# EAGLE board enigma (EAGLE 7.7.0), part 1 of 2
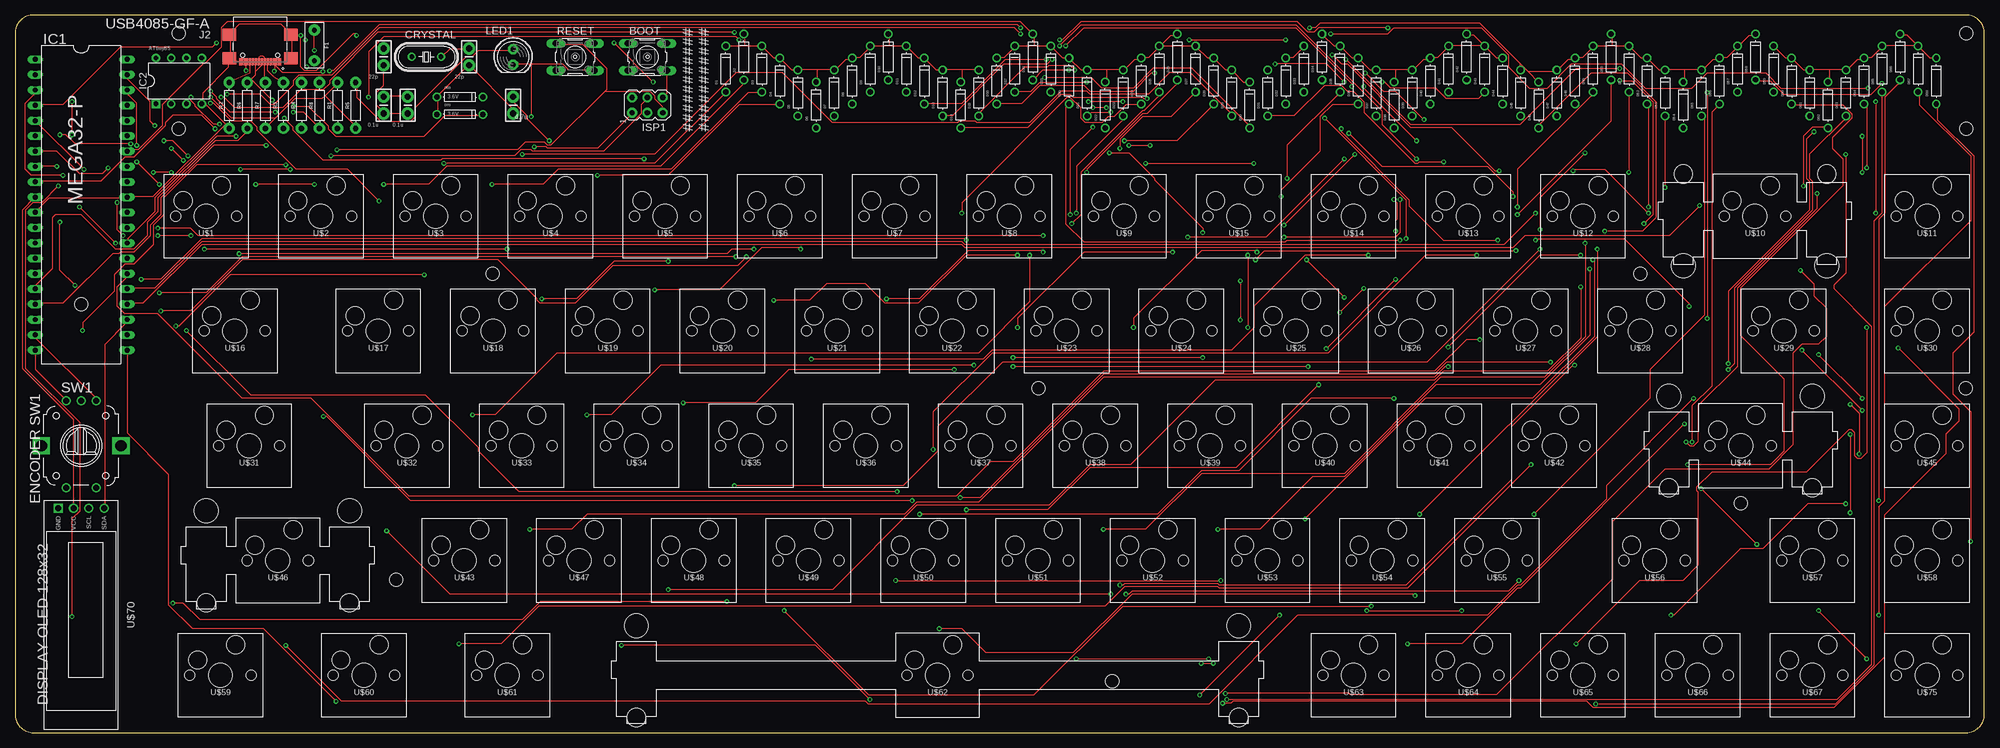
[diagram p2: board, top side]
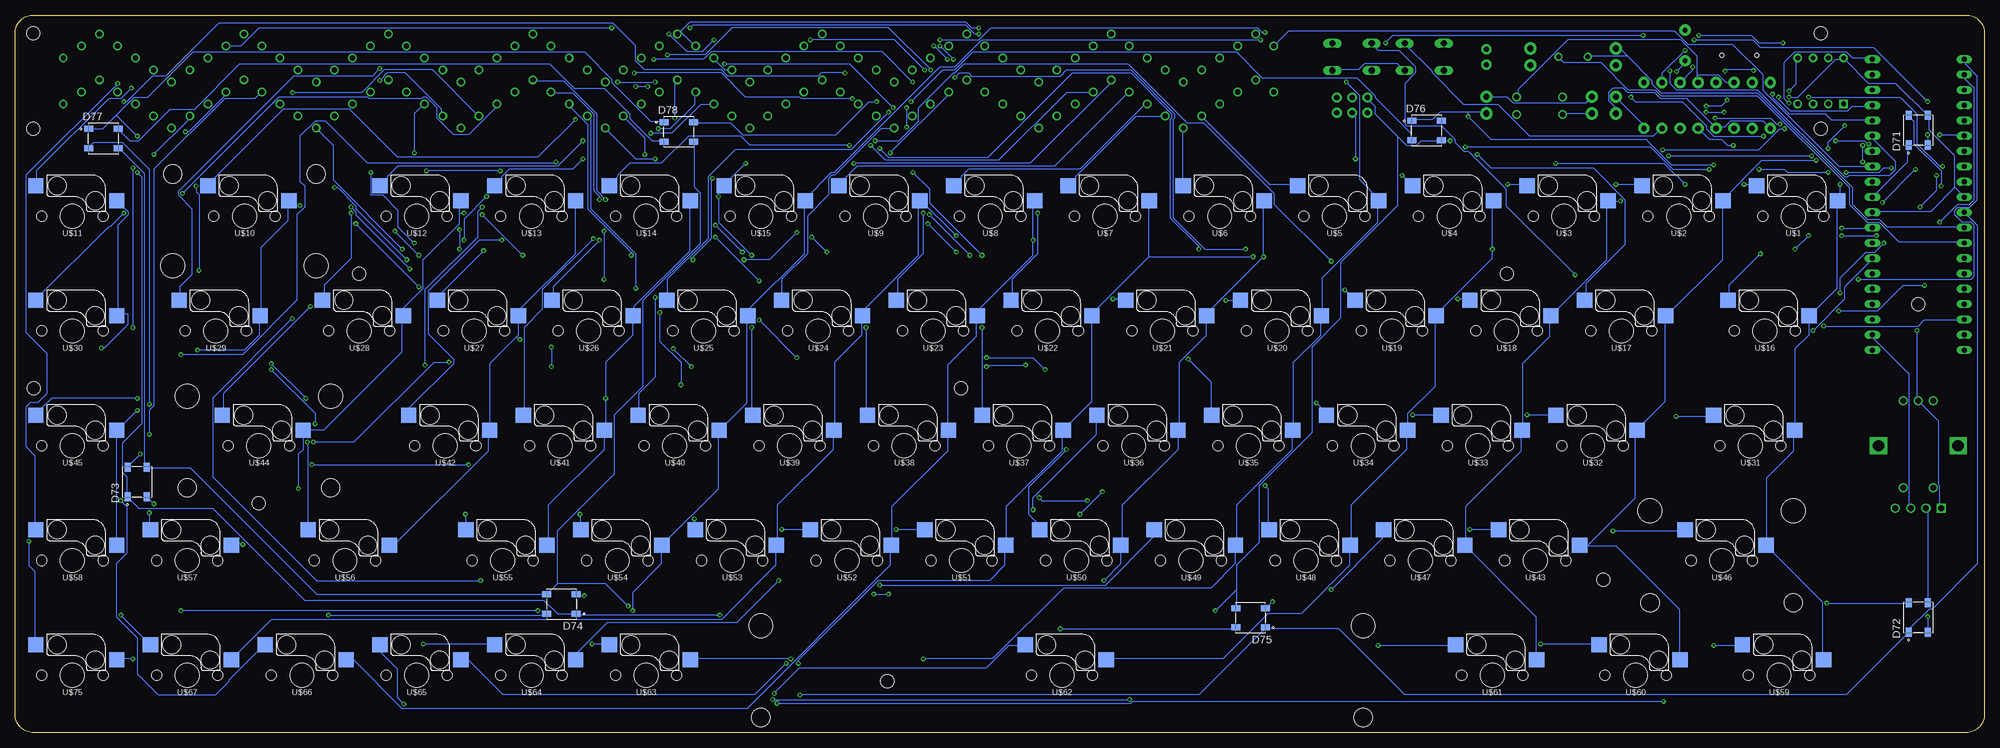
[diagram p3: board, bottom side, seen from below]

Size 327 x 119.12 mm. Coordinates in mm from the lower left corner, seen from the top.
Outline: 327,3.07 327,116.05 arc90 323.93,119.12 3.07,119.12 arc90 0,116.05 0,3.07 arc90 3.07,0 323.93,0 arc90 327,3.07
Copper layers (1*16): Top 0.035mm / dielectric 1.5mm / Bottom 0.035mm
Design rules "default *": minimum track width 6mil, minimum drill 0.35mm, track to track 6mil, track to pad 6mil, pad to pad 6mil, via to via 6mil, smd to smd 6mil, copper to edge 40mil, drill to drill 6mil, minimum pad ring 10mil, minimum via ring 8mil, stop-mask expansion 4mil, vias tented up to drill 0mil, thermal gap 10mil
Holes 2.2 mm at 27.2,116.12 27.2,100.25 324,116.12 324,100.25 269.85,76.2 182.17,8.5 10.97,71.11 323.9,57.15 169.95,57.15 79.33,76.2 286.52,38.1 63.25,25.39

## Footprints (pad centres in the part's own frame; a part is rotated, then mirrored left to right if it is on the bottom)
B3F-10XX = drill 1.016 long: 1 -3.251,2.261; 2 3.251,2.261; 3 -3.251,-2.261; 4 3.251,-2.261
HC49U-V = drill 0.813: 1 -2.413,0; 2 2.413,0
DO-1N4148 = drill 0.9: A -3.81,0; C 3.81,0
LED_1655 = smd 1.5 x 1: 1 -2.45,1.6; 2 -2.45,-1.6; 3 2.45,-1.6; 4 2.45,1.6
PTH = drill 0.8 pad 1.88: P$1 -2.54,0; P$2 2.54,0
DIL40 = drill 0.813 long: 1 -24.13,-7.62; 2 -21.59,-7.62; 3 -19.05,-7.62; 4 -16.51,-7.62; 5 -13.97,-7.62; 6 -11.43,-7.62; 7 -8.89,-7.62; 8 -6.35,-7.62; 9 -3.81,-7.62; 10 -1.27,-7.62; 11 1.27,-7.62; 12 3.81,-7.62; 13 6.35,-7.62; 14 8.89,-7.62; 15 11.43,-7.62; 16 13.97,-7.62; 17 16.51,-7.62; 18 19.05,-7.62; 19 21.59,-7.62; 20 24.13,-7.62; 21 24.13,7.62; 22 21.59,7.62; 23 19.05,7.62; 24 16.51,7.62; 25 13.97,7.62; 26 11.43,7.62; 27 8.89,7.62; 28 6.35,7.62; 29 3.81,7.62; 30 1.27,7.62; 31 -1.27,7.62; 32 -3.81,7.62; 33 -6.35,7.62; 34 -8.89,7.62; 35 -11.43,7.62; 36 -13.97,7.62; 37 -16.51,7.62; 38 -19.05,7.62; 39 -21.59,7.62; 40 -24.13,7.62
DIL08 = drill 0.8 pad 1.4 square: 1 -3.81,-3.81 | drill 0.8 pad 1.4: 2 -1.27,-3.81; 3 1.27,-3.81; 4 3.81,-3.81; 5 3.81,3.81; 6 1.27,3.81; 7 -1.27,3.81; 8 -3.81,3.81
AVRISP = drill 0.9 pad 1.626: 1 -1.27,2.54; 2 1.27,2.54; 3 -1.27,0; 4 1.27,0; 5 -1.27,-2.54; 6 1.27,-2.54
GCT_USB4110-GF-A_REVB = smd 0.6 x 1.15: A1/B12 -3.2,1.075; A4/B9 -2.4,1.075; B1/A12 3.2,1.075; B4/A9 2.4,1.075 | smd 0.3 x 1.15: A5 -1.25,1.075; A6 -0.25,1.075; A7 0.25,1.075; A8 1.25,1.075; B5 1.75,1.075; B6 0.75,1.075; B7 -0.75,1.075; B8 -1.75,1.075 | smd 2.18 x 2: S1 -5.11,0.5; S2 5.11,0.5; S3 -5.11,-3.43; S4 5.11,-3.43 | hole 0.65: -2.89,0; 2.89,0
LED5MM = drill 0.813 pad 1.676 octagon: A -1.27,0; K 1.27,0
AXIAL-0.3 = drill 0.9 pad 1.88: P$1 -3.81,0; P$2 3.81,0
PEC12_INCREMENTAL_ENCODER = drill 1: A -2.5,-7.5; B 2.5,-7.5; C 0,-7.5; P1 -2.5,7; P2 2.5,7 | drill 1.9 square: GND@1 -6.6,0; GND@2 6.6,0
MXHSPCB-1U = smd 2.55 x 2.5: MX1 7.36,2.54; MX2 -6.09,5.08 | hole 4: 0,0 | hole 1.7: 5.08,0; -5.08,0 | hole 3: 3.81,2.54; -2.54,5.08
MXHSPCB-2U = smd 2.55 x 2.5: MX1 7.36,2.54; MX2 -6.09,5.08 | hole 4: 0,0; -11.9,-8.24; 11.9,-8.24 | hole 1.7: 5.08,0; -5.08,0 | hole 3: 3.81,2.54; -2.54,5.08 | hole 3.05: -11.9,7; 11.9,7
MXHSPCB-2U-FLIPPED = smd 2.55 x 2.5: MX1 7.36,2.54; MX2 -6.09,5.08 | hole 4: 0,0; -11.9,8.24; 11.9,8.24 | hole 1.7: 5.08,0; -5.08,0 | hole 3: 3.81,2.54; -2.54,5.08 | hole 3.05: -11.9,-7; 11.9,-7
MXHSPCB-6.25U-FLIPPED = smd 2.55 x 2.5: MX1 7.36,2.54; MX2 -6.09,5.08 | hole 4: 0,0; -50,8.24; 50,8.24 | hole 1.7: 5.08,0; -5.08,0 | hole 3: 3.81,2.54; -2.54,5.08 | hole 3.05: -50,-7; 50,-7
CAP-TH = drill 1.016 pad 2.032: 1 -1.397,0; 2 1.397,0
DISPLAY-OLED-128X32 = drill 1 square: 1 -17.78,-3.81 | drill 1: 2 -17.78,-1.27; 3 -17.78,1.27; 4 -17.78,3.81

## Placement (x,y rotation side)
BOOT  BOOT  [B3F-10XX]  105,112.17 0 top
CRYSTAL  16MHZ  [HC49U-V]  68.3,112.17 0 top
D1  [DO-1N4148]  118,110.17 90 top
D2  [DO-1N4148]  121,112.17 90 top
D3  [DO-1N4148]  124,110.17 90 top
D4  [DO-1N4148]  127,108.17 90 top
D5  [DO-1N4148]  130,106.17 90 top
D6  [DO-1N4148]  133,104.17 90 top
D7  [DO-1N4148]  136,106.17 90 top
D8  [DO-1N4148]  139,108.17 90 top
D9  [DO-1N4148]  142,110.17 90 top
D10  [DO-1N4148]  145,112.17 90 top
D11  [DO-1N4148]  148,110.17 90 top
D12  [DO-1N4148]  151,108.17 90 top
D13  [DO-1N4148]  154,106.17 90 top
D14  [DO-1N4148]  157,104.17 90 top
D15  [DO-1N4148]  160,106.17 90 top
D16  [DO-1N4148]  163,108.17 90 top
D17  [DO-1N4148]  166,110.17 90 top
D18  [DO-1N4148]  169,112.17 90 top
D19  [DO-1N4148]  172,110.17 90 top
D20  [DO-1N4148]  175,108.17 90 top
D21  [DO-1N4148]  178,106.17 90 top
D22  [DO-1N4148]  181,104.17 90 top
D23  [DO-1N4148]  184,106.17 90 top
D24  [DO-1N4148]  187,108.17 90 top
D25  [DO-1N4148]  190,110.17 90 top
D26  [DO-1N4148]  193,112.17 90 top
D27  [DO-1N4148]  196,110.17 90 top
D28  [DO-1N4148]  199,108.17 90 top
D29  [DO-1N4148]  202,106.17 90 top
D30  [DO-1N4148]  205,104.17 90 top
D31  [DO-1N4148]  208,106.17 90 top
D32  [DO-1N4148]  211,108.17 90 top
D33  [DO-1N4148]  214,110.18 90 top
D34  [DO-1N4148]  217,112.18 90 top
D35  [DO-1N4148]  220,110.18 90 top
D36  [DO-1N4148]  223,108.18 90 top
D37  [DO-1N4148]  226,106.18 90 top
D38  [DO-1N4148]  229,104.18 90 top
D39  [DO-1N4148]  232,106.18 90 top
D40  [DO-1N4148]  235,108.18 90 top
D41  [DO-1N4148]  238,110.18 90 top
D42  [DO-1N4148]  241,112.18 90 top
D43  [DO-1N4148]  244,110.18 90 top
D44  [DO-1N4148]  247,108.18 90 top
D45  [DO-1N4148]  250,106.18 90 top
D46  [DO-1N4148]  253,104.18 90 top
D47  [DO-1N4148]  256,106.18 90 top
D48  [DO-1N4148]  259,108.18 90 top
D49  [DO-1N4148]  262,110.18 90 top
D50  [DO-1N4148]  265,112.18 90 top
D51  [DO-1N4148]  268,110.18 90 top
D52  [DO-1N4148]  271,108.18 90 top
D53  [DO-1N4148]  274,106.18 90 top
D54  [DO-1N4148]  277,104.18 90 top
D55  [DO-1N4148]  280,106.18 90 top
D56  [DO-1N4148]  283,108.18 90 top
D57  [DO-1N4148]  286,110.18 90 top
D58  [DO-1N4148]  289,112.18 90 top
D59  [DO-1N4148]  292,110.18 90 top
D60  [DO-1N4148]  295,108.18 90 top
D61  [DO-1N4148]  298,106.18 90 top
D62  [DO-1N4148]  301,104.18 90 top
D63  [DO-1N4148]  304,106.18 90 top
D64  [DO-1N4148]  307,108.18 90 top
D65  [DO-1N4148]  310,110.18 90 top
D66  [DO-1N4148]  313,112.18 90 top
D67  [DO-1N4148]  316,110.18 90 top
D68  [DO-1N4148]  319,108.18 90 top
D69  3.6V  [DO-1N4148]  73.87,105.51 0 top
D70  3.6V  [DO-1N4148]  73.87,102.64 0 top
D71  1655  [LED_1655]  10.97,100 90 bottom
D72  1655  [LED_1655]  10.97,19.12 90 bottom
D73  1655  [LED_1655]  306.73,41.6 90 bottom
D74  1655  [LED_1655]  236.26,21.34 180 bottom
D75  1655  [LED_1655]  121.87,19.07 180 bottom
D76  1655  [LED_1655]  92.61,99.95 0 bottom
D77  1655  [LED_1655]  312.31,98.64 0 bottom
D78  1655  [LED_1655]  216.78,99.72 0 bottom
F1  500mA  [PTH]  49.7,114.07 270 top
IC1  MEGA32-P  [DIL40]  10.97,87.62 270 top
IC2  ATTINY25-20PU  [DIL08]  27.2,108.18 0 top
ISP1  AVRISP-6  [AVRISP]  105,104.17 90 top
J2  USB4110-GF-A_REVB  [GCT_USB4110-GF-A_REVB]  40.7,112.45 180 top
LED1  [LED5MM]  82.7,112.17 270 top
R1  10k  [AXIAL-0.3]  53.56,104.13 90 top
R2  5.1k  [AXIAL-0.3]  35.56,104.13 270 top
R3  5.1k  [AXIAL-0.3]  44.56,104.13 90 top
R4  75  [AXIAL-0.3]  47.56,104.13 90 top
R5  1k  [AXIAL-0.3]  56.56,104.13 90 top
R6  75  [AXIAL-0.3]  38.56,104.13 90 top
R7  1.5k  [AXIAL-0.3]  41.56,104.13 270 top
R8  100  [AXIAL-0.3]  50.56,104.13 270 top
RESET  RESET  [B3F-10XX]  93,112.17 0 top
SW1  ENCODER_SW1-PEC12  [PEC12_INCREMENTAL_ENCODER]  10.97,47.63 180 top
U$1  KEYSWITCH-PLAIN-MXHSPCB-1U  [MXHSPCB-1U]  31.72,85.73 0 bottom
U$2  KEYSWITCH-PLAIN-MXHSPCB-1U  [MXHSPCB-1U]  50.77,85.73 0 bottom
U$3  KEYSWITCH-PLAIN-MXHSPCB-1U  [MXHSPCB-1U]  69.82,85.73 0 bottom
U$4  KEYSWITCH-PLAIN-MXHSPCB-1U  [MXHSPCB-1U]  88.87,85.73 0 bottom
U$5  KEYSWITCH-PLAIN-MXHSPCB-1U  [MXHSPCB-1U]  107.92,85.73 0 bottom
U$6  KEYSWITCH-PLAIN-MXHSPCB-1U  [MXHSPCB-1U]  126.97,85.73 0 bottom
U$7  KEYSWITCH-PLAIN-MXHSPCB-1U  [MXHSPCB-1U]  146.02,85.73 0 bottom
U$8  KEYSWITCH-PLAIN-MXHSPCB-1U  [MXHSPCB-1U]  165.07,85.73 0 bottom
U$9  KEYSWITCH-PLAIN-MXHSPCB-1U  [MXHSPCB-1U]  184.12,85.73 0 bottom
U$10  KEYSWITCH-PLAIN-MXHSPCB-2U  [MXHSPCB-2U]  288.9,85.73 0 bottom
U$11  KEYSWITCH-PLAIN-MXHSPCB-1U  [MXHSPCB-1U]  317.47,85.73 0 bottom
U$12  KEYSWITCH-PLAIN-MXHSPCB-1U  [MXHSPCB-1U]  260.32,85.73 0 bottom
U$13  KEYSWITCH-PLAIN-MXHSPCB-1U  [MXHSPCB-1U]  241.27,85.73 0 bottom
U$14  KEYSWITCH-PLAIN-MXHSPCB-1U  [MXHSPCB-1U]  222.22,85.73 0 bottom
U$15  KEYSWITCH-PLAIN-MXHSPCB-1U  [MXHSPCB-1U]  203.17,85.73 0 bottom
U$16  KEYSWITCH-PLAIN-MXHSPCB-1U  [MXHSPCB-1U]  36.49,66.68 0 bottom
U$17  KEYSWITCH-PLAIN-MXHSPCB-1U  [MXHSPCB-1U]  60.3,66.68 0 bottom
U$18  KEYSWITCH-PLAIN-MXHSPCB-1U  [MXHSPCB-1U]  79.35,66.68 0 bottom
U$19  KEYSWITCH-PLAIN-MXHSPCB-1U  [MXHSPCB-1U]  98.4,66.68 0 bottom
U$20  KEYSWITCH-PLAIN-MXHSPCB-1U  [MXHSPCB-1U]  117.45,66.68 0 bottom
U$21  KEYSWITCH-PLAIN-MXHSPCB-1U  [MXHSPCB-1U]  136.5,66.68 0 bottom
U$22  KEYSWITCH-PLAIN-MXHSPCB-1U  [MXHSPCB-1U]  155.55,66.68 0 bottom
U$23  KEYSWITCH-PLAIN-MXHSPCB-1U  [MXHSPCB-1U]  174.6,66.68 0 bottom
U$24  KEYSWITCH-PLAIN-MXHSPCB-1U  [MXHSPCB-1U]  193.65,66.68 0 bottom
U$25  KEYSWITCH-PLAIN-MXHSPCB-1U  [MXHSPCB-1U]  212.7,66.68 0 bottom
U$26  KEYSWITCH-PLAIN-MXHSPCB-1U  [MXHSPCB-1U]  231.75,66.68 0 bottom
U$27  KEYSWITCH-PLAIN-MXHSPCB-1U  [MXHSPCB-1U]  250.8,66.68 0 bottom
U$28  KEYSWITCH-PLAIN-MXHSPCB-1U  [MXHSPCB-1U]  269.85,66.68 0 bottom
U$29  KEYSWITCH-PLAIN-MXHSPCB-1U  [MXHSPCB-1U]  293.66,66.68 0 bottom
U$30  KEYSWITCH-PLAIN-MXHSPCB-1U  [MXHSPCB-1U]  317.47,66.68 0 bottom
U$31  KEYSWITCH-PLAIN-MXHSPCB-1U  [MXHSPCB-1U]  38.87,47.63 0 bottom
U$32  KEYSWITCH-PLAIN-MXHSPCB-1U  [MXHSPCB-1U]  65.06,47.63 0 bottom
U$33  KEYSWITCH-PLAIN-MXHSPCB-1U  [MXHSPCB-1U]  84.11,47.63 0 bottom
U$34  KEYSWITCH-PLAIN-MXHSPCB-1U  [MXHSPCB-1U]  103.16,47.63 0 bottom
U$35  KEYSWITCH-PLAIN-MXHSPCB-1U  [MXHSPCB-1U]  122.21,47.63 0 bottom
U$36  KEYSWITCH-PLAIN-MXHSPCB-1U  [MXHSPCB-1U]  141.26,47.63 0 bottom
U$37  KEYSWITCH-PLAIN-MXHSPCB-1U  [MXHSPCB-1U]  160.31,47.63 0 bottom
U$38  KEYSWITCH-PLAIN-MXHSPCB-1U  [MXHSPCB-1U]  179.36,47.63 0 bottom
U$39  KEYSWITCH-PLAIN-MXHSPCB-1U  [MXHSPCB-1U]  198.41,47.63 0 bottom
U$40  KEYSWITCH-PLAIN-MXHSPCB-1U  [MXHSPCB-1U]  217.46,47.63 0 bottom
U$41  KEYSWITCH-PLAIN-MXHSPCB-1U  [MXHSPCB-1U]  236.51,47.63 0 bottom
U$42  KEYSWITCH-PLAIN-MXHSPCB-1U  [MXHSPCB-1U]  255.56,47.63 0 bottom
U$43  KEYSWITCH-PLAIN-MXHSPCB-1U  [MXHSPCB-1U]  74.59,28.58 0 bottom
U$44  KEYSWITCH-PLAIN-MXHSPCB-2U-FLIPPED  [MXHSPCB-2U-FLIPPED]  286.52,47.63 0 bottom
U$45  KEYSWITCH-PLAIN-MXHSPCB-1U  [MXHSPCB-1U]  317.47,47.63 0 bottom
U$46  KEYSWITCH-PLAIN-MXHSPCB-2U-FLIPPED  [MXHSPCB-2U-FLIPPED]  43.63,28.58 0 bottom
U$47  KEYSWITCH-PLAIN-MXHSPCB-1U  [MXHSPCB-1U]  93.64,28.58 0 bottom
U$48  KEYSWITCH-PLAIN-MXHSPCB-1U  [MXHSPCB-1U]  112.69,28.58 0 bottom
U$49  KEYSWITCH-PLAIN-MXHSPCB-1U  [MXHSPCB-1U]  131.74,28.58 0 bottom
U$50  KEYSWITCH-PLAIN-MXHSPCB-1U  [MXHSPCB-1U]  150.79,28.58 0 bottom
U$51  KEYSWITCH-PLAIN-MXHSPCB-1U  [MXHSPCB-1U]  169.84,28.58 0 bottom
U$52  KEYSWITCH-PLAIN-MXHSPCB-1U  [MXHSPCB-1U]  188.89,28.58 0 bottom
U$53  KEYSWITCH-PLAIN-MXHSPCB-1U  [MXHSPCB-1U]  207.94,28.58 0 bottom
U$54  KEYSWITCH-PLAIN-MXHSPCB-1U  [MXHSPCB-1U]  226.99,28.58 0 bottom
U$55  KEYSWITCH-PLAIN-MXHSPCB-1U  [MXHSPCB-1U]  246.04,28.58 0 bottom
U$56  KEYSWITCH-PLAIN-MXHSPCB-1U  [MXHSPCB-1U]  272.23,28.58 0 bottom
U$57  KEYSWITCH-PLAIN-MXHSPCB-1U  [MXHSPCB-1U]  298.42,28.58 0 bottom
U$58  KEYSWITCH-PLAIN-MXHSPCB-1U  [MXHSPCB-1U]  317.47,28.58 0 bottom
U$59  KEYSWITCH-PLAIN-MXHSPCB-1U  [MXHSPCB-1U]  34.11,9.53 0 bottom
U$60  KEYSWITCH-PLAIN-MXHSPCB-1U  [MXHSPCB-1U]  57.92,9.53 0 bottom
U$61  KEYSWITCH-PLAIN-MXHSPCB-1U  [MXHSPCB-1U]  81.73,9.53 0 bottom
U$62  KEYSWITCH-PLAIN-MXHSPCB-6.25U-FLIPPED  [MXHSPCB-6.25U-FLIPPED]  153.17,9.53 0 bottom
U$63  KEYSWITCH-PLAIN-MXHSPCB-1U  [MXHSPCB-1U]  222.22,9.53 0 bottom
U$64  KEYSWITCH-PLAIN-MXHSPCB-1U  [MXHSPCB-1U]  241.27,9.53 0 bottom
U$65  KEYSWITCH-PLAIN-MXHSPCB-1U  [MXHSPCB-1U]  260.32,9.53 0 bottom
U$66  KEYSWITCH-PLAIN-MXHSPCB-1U  [MXHSPCB-1U]  279.37,9.53 0 bottom
U$67  KEYSWITCH-PLAIN-MXHSPCB-1U  [MXHSPCB-1U]  298.42,9.53 0 bottom
U$68  22p  [CAP-TH]  75.4,112.17 270 top
U$69  22p  [CAP-TH]  61.2,112.17 90 top
U$70  DISPLAY-OLED-128X32  [DISPLAY-OLED-128X32]  10.97,19.5 270 top
U$71  4.7u  [CAP-TH]  82.7,104.17 90 top
U$72  0.1u  [CAP-TH]  65.2,104.17 90 top
U$73  0.1u  [CAP-TH]  61.2,104.17 90 top
U$75  KEYSWITCH-PLAIN-MXHSPCB-1U  [MXHSPCB-1U]  317.47,9.53 0 bottom